# Altium schematic sheet MPU 9250.SchDoc
size A4
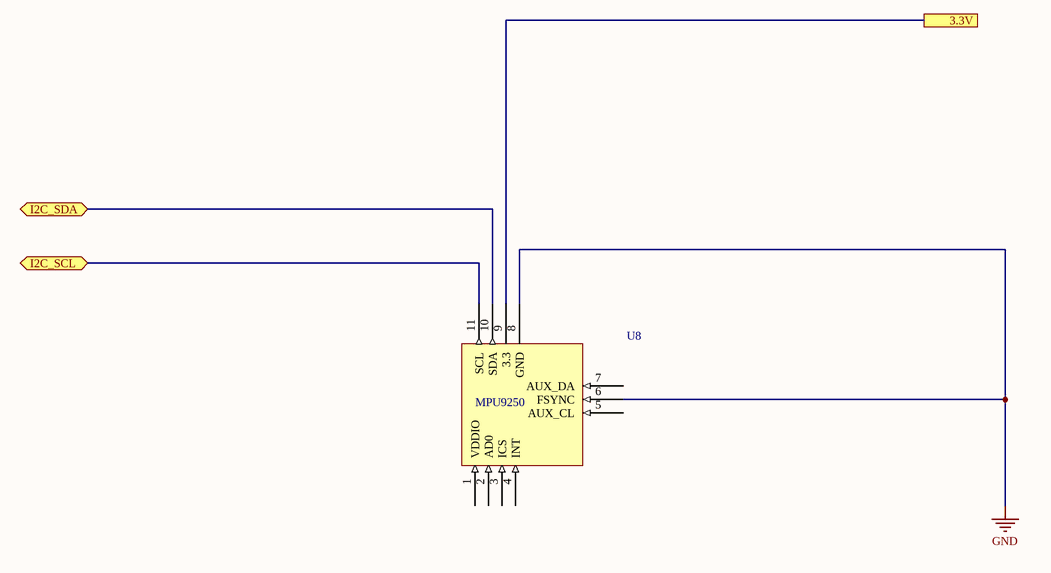
[diagram p0: MPU 9250.SchDoc]

## Parts
U8  (no value)  [MPU-9250_CONECTOR]

## Ports
3.3V, I2C_SCL (bidir), I2C_SDA (bidir)

## Nets
GND: U8.6(FSYNC) U8.8(GND)
3.3V: U8.9(3.3) ; port 3.3V
I2C_SCL: U8.11(SCL) ; port I2C_SCL
I2C_SDA: U8.10(SDA) ; port I2C_SDA

Not connected (* = marked no-connect by the designer): U8 1(VDDIO) 2(AD0) 3(ICS) 4(INT) 5(AUX_CL) 7(AUX_DA)

## Notes on the sheet
- (in symbol U8) MPU9250

## Library data of the parts
U8 = (no symbol name): SPARKFUN MPU9250 GYROSCOPE